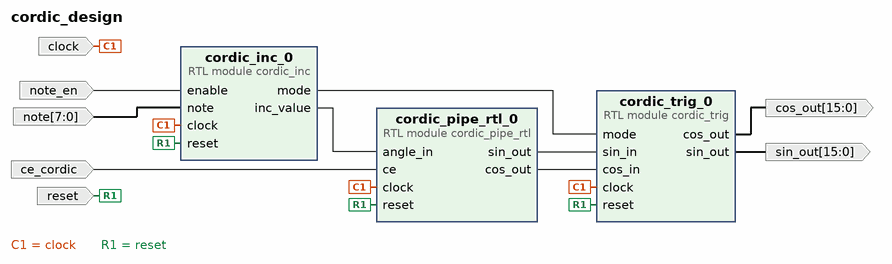
[diagram p0: block diagram of the top level]
# Vivado block design cordic_design, xc7z020clg484-1, Vivado 2016.4
create_bd_design cordic_design

create_bd_port -dir I clock
create_bd_port -dir I reset
create_bd_port -dir I note_en
create_bd_port -dir I -from 7 -to 0 note
create_bd_port -dir I ce_cordic
create_bd_port -dir O -from 15 -to 0 sin_out
create_bd_port -dir O -from 15 -to 0 cos_out

create_bd_cell -type module -reference cordic_pipe_rtl cordic_pipe_rtl_0
create_bd_cell -type module -reference cordic_inc cordic_inc_0
create_bd_cell -type module -reference cordic_trig cordic_trig_0

# ---- connections ----

connect_bd_net [get_bd_pins cordic_inc_0/mode] [get_bd_pins cordic_trig_0/mode]
connect_bd_net [get_bd_pins cordic_inc_0/inc_value] [get_bd_pins cordic_pipe_rtl_0/angle_in]
connect_bd_net [get_bd_ports clock] [get_bd_pins cordic_pipe_rtl_0/clock] [get_bd_pins cordic_inc_0/clock] [get_bd_pins cordic_trig_0/clock]
connect_bd_net [get_bd_ports reset] [get_bd_pins cordic_pipe_rtl_0/reset] [get_bd_pins cordic_inc_0/reset] [get_bd_pins cordic_trig_0/reset]
connect_bd_net [get_bd_pins cordic_pipe_rtl_0/sin_out] [get_bd_pins cordic_trig_0/sin_in]
connect_bd_net [get_bd_pins cordic_pipe_rtl_0/cos_out] [get_bd_pins cordic_trig_0/cos_in]
connect_bd_net [get_bd_ports note_en] [get_bd_pins cordic_inc_0/enable]
connect_bd_net [get_bd_ports note] [get_bd_pins cordic_inc_0/note]
connect_bd_net [get_bd_ports ce_cordic] [get_bd_pins cordic_pipe_rtl_0/ce]
connect_bd_net [get_bd_pins cordic_trig_0/sin_out] [get_bd_ports sin_out]
connect_bd_net [get_bd_pins cordic_trig_0/cos_out] [get_bd_ports cos_out]

validate_bd_design
save_bd_design
